# Altium schematic sheet USB.SchDoc
size A4
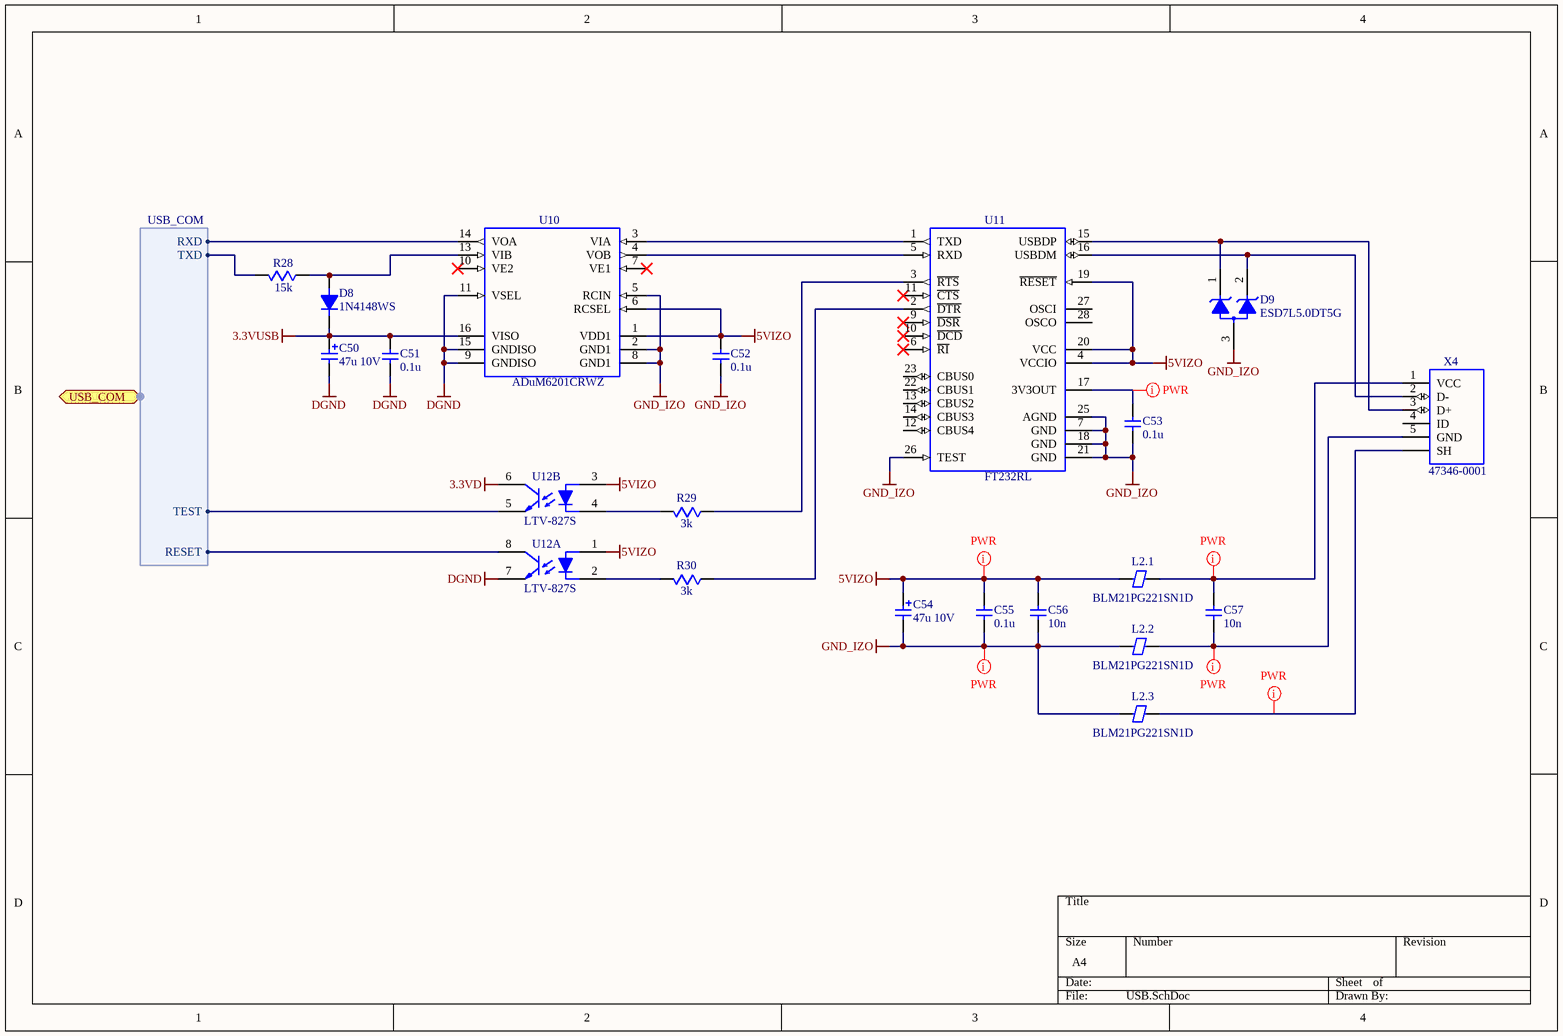
[diagram p0: USB.SchDoc]

## Parts
C50  47u 10V  [SMD/C/TAJ-B]
C51  0.1u  [SMD/C/0603]
C52  0.1u  [SMD/C/0603]
C53  0.1u  [SMD/C/0603]
C54  47u 10V  [SMD/C/TAJ-B]
C55  0.1u  [SMD/C/0603]
C56  10n  [SMD/C/0603]
C57  10n  [SMD/C/0603]
D8  1N4148WS  [SMD/SOD-323]
D9  ESD7L5.0DT5G  [SMD/SOT723]
L2.1  BLM21PG221SN1D  [SMD/C/0805]
L2.2  BLM21PG221SN1D  [SMD/C/0805]
L2.3  BLM21PG221SN1D  [SMD/C/0805]
R28  15k  [SMD/R/0603]
R29  3k  [SMD/R/0603]
R30  3k  [SMD/R/0603]
U10  ADuM6201CRWZ  [SMD/SOIC16/1.27MMP/7.5x10.3mm/10.6MMWP]
U11  FT232RL  [SMD/SOP28/0.65MMP/5.3x10.2mm/7.9MMWP]
U12  LTV-827S  [SMD/DIP8/2.54MMP/9.68x6.5MM/10.16MMWP]  (parts A,B of 2)
X4  47346-0001  [47346-0001]

## Ports
USB_COM (harness USB_COM)

## Harnesses
USB_COM: RXD, TXD, TEST, RESET

## Nets
3.3VD: U12.6(C)
3.3VUSB: C50.P C51.2 D8.C U10.16(VISO)
5VIZO: C52.2 C54.P C55.2 C56.2 L2.1.1 U10.1(VDD1) U10.6(RCSEL) U11.4(VCCIO) U11.19(~{RESET}) U11.20(VCC) U12.1(A) U12.3(A)
DGND: C50.M C51.1 U10.9(GNDISO) U10.11(VSEL) U10.15(GNDISO) U12.7(E)
GND_IZO: C52.1 C53.1 C54.M C55.1 C56.1 D9.3 L2.2.1 L2.3.1 U10.2(GND1) U10.5(RCIN) U10.8(GND1) U11.7(GND) U11.18(GND) U11.21(GND) U11.25(AGND) U11.26(TEST)
NetC53_2: C53.2 U11.17(3V3OUT)
NetC57_1: C57.1 L2.2.2 X4.5(GND)
NetC57_2: C57.2 L2.1.2 X4.1(VCC)
NetD8_A: D8.A R28.1 U10.13(VIB)
NetD9_1: D9.1 U11.15(USBDP) X4.3(D+)
NetD9_2: D9.2 U11.16(USBDM) X4.2(D-)
NetL2.3_2: L2.3.2 X4.CASE(SH)
NetR28_2: R28.2 ; port USB_COM.TXD
NetR29_1: R29.1 U11.3(~{RTS})
NetR29_2: R29.2 U12.4(C)
NetR30_1: R30.1 U11.2(~{DTR})
NetR30_2: R30.2 U12.2(C)
NetU10_3: U10.3(VIA) U11.1(TXD)
NetU10_4: U10.4(VOB) U11.5(RXD)
NetU10_14: U10.14(VOA) ; port USB_COM.RXD
NetU12_5: U12.5(E) ; port USB_COM.TEST
NetU12_8: U12.8(C) ; port USB_COM.RESET

Not connected (* = marked no-connect by the designer): U10 7(VE1)* 10(VE2)*; U11 6(~{RI})* 9(~{DSR})* 10(~{DCD})* 11(~{CTS})* 12(CBUS4) 13(CBUS2) 14(CBUS3) 22(CBUS1) 23(CBUS0) 27(OSCI) 28(OSCO); X4 4(ID)

## Layout directives
net class POWER: 5VIZO, GND_IZO, NetC53_2, NetC57_1, NetC57_2, NetL2.3_2

## Library data of the parts
C50 C54 = Capacitor Pol: Value: 47u 10V
C51-C53 C55-C57 = Capacitor
  C51-C53 C55: Value: 0.1u
  C56 C57: Value: 10n
D8 = Diode: Value: 1N4148WS
D9 = ESD7L5.0DT5G: ESD Protection Diodes with Ultra?Low Capacitance; Value: ESD7L5.0DT5G
R28-R30 = Resistor
  R28: Value: 15k
  R29 R30: Value: 3k
U10 = ADuM6201: Dual-Channel, 5 kV Isolators with Integrated DC-to-DC Converter; Value: ADuM6201CRWZ
U11 = FT232RL: USB to RS232 / RS422 / RS485 Converters; Value: FT232RL
X4 = MicroUSB Connector: USB Connector; Value: 47346-0001
L2.1-L2.3 = BLM21PG221SN1D: Value: BLM21PG221SN1D
U12 = LTV-827S: Value: LTV-827S